# Altium schematic sheet 1_P1.schdoc
size 309 x 223 mm; Symbol: Sheet-Symbol_A4; Device: Sheet-Symbol_A4; @Page Name: P1; @Create Date: 2023-03-25; @Page Count: 1; @Page No: 1; @Project Name: NEW_clock; @Schematic Name: Schematic1; @Update Date: 2023-04-16; Company: 嘉立创EDA; Page Size: A4; Version: V1.0
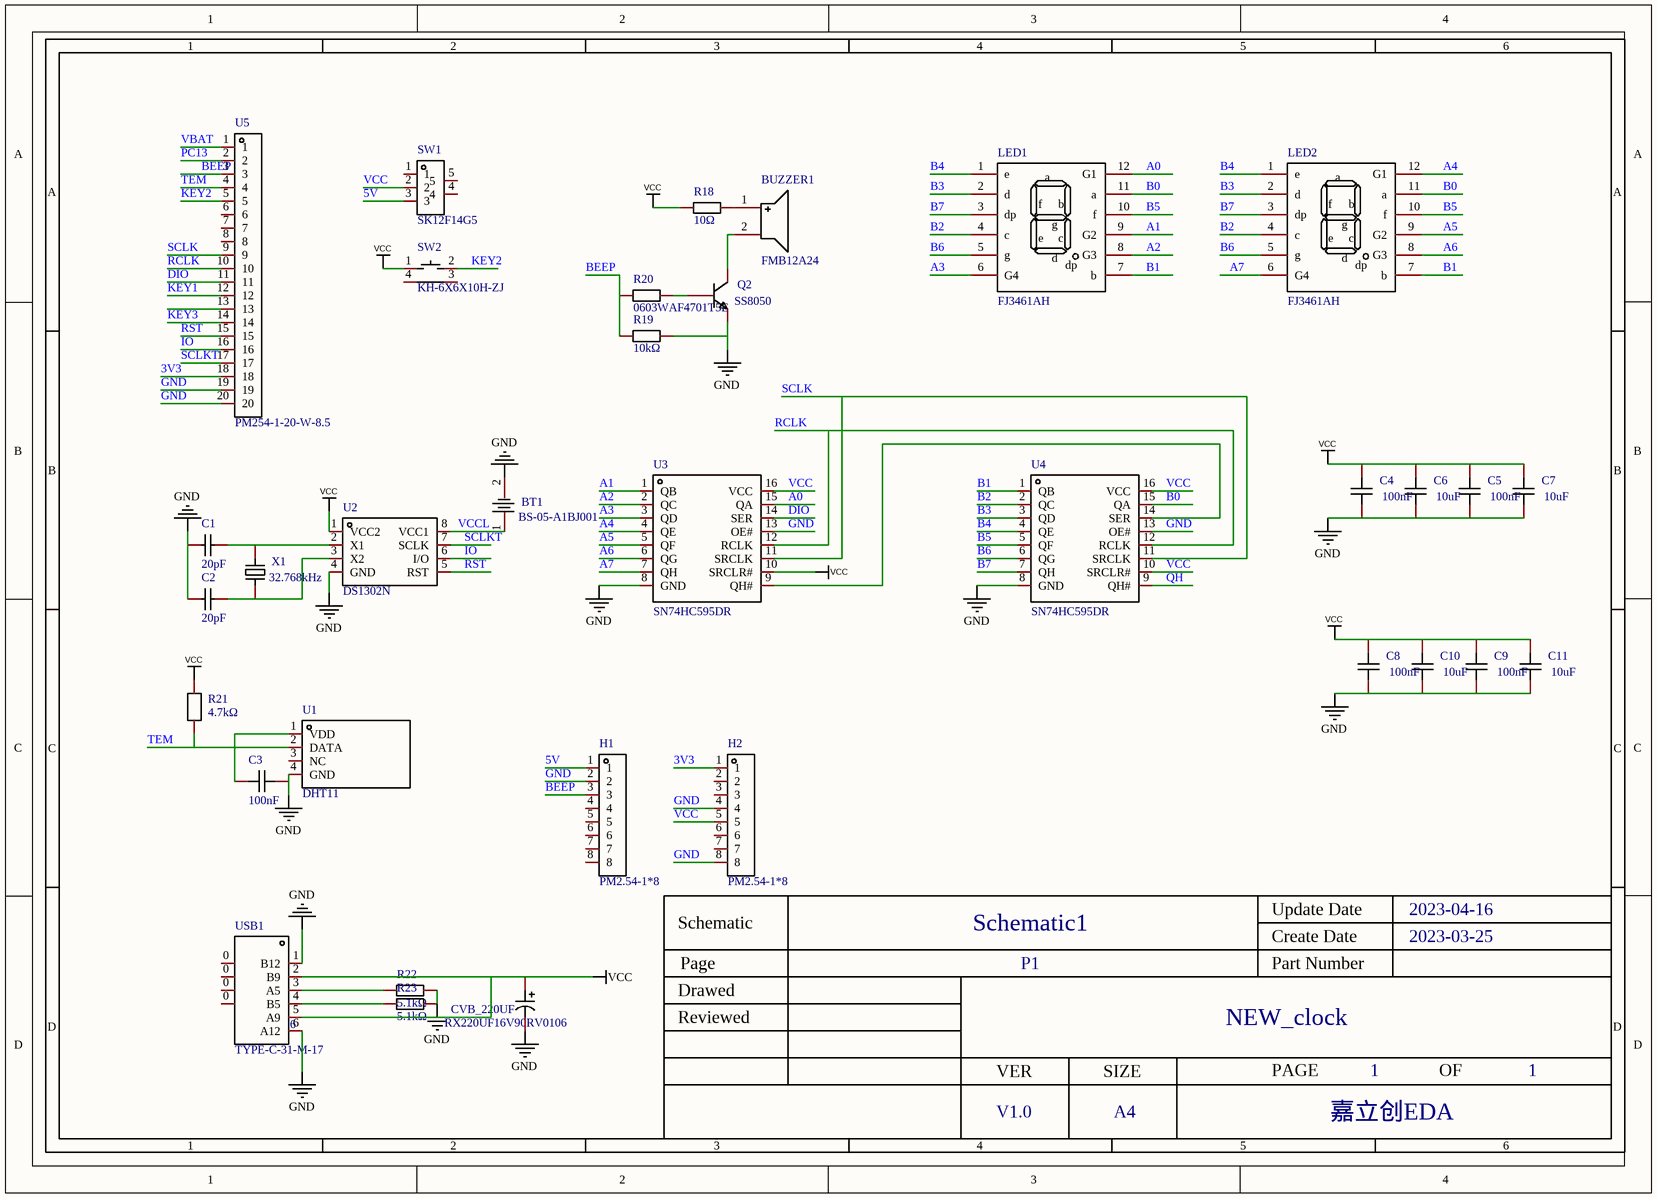
[diagram p0: 1_P1.schdoc]

## Parts
BT1  BS-05-A1BJ001  [BAT-TH_BS-05-A1BJ001]
BUZZER1  FMB12A24  [BUZ-TH_BD12.0-P7.60-D0.6-FD]
C1  20pF  [C0603]
C2  20pF  [C0603]
C3  100nF  [C0603]
C4  100nF  [C0603]
C5  100nF  [C0603]
C6  10uF  [C0603]
C7  10uF  [C0603]
C8  100nF  [C0603]
C9  100nF  [C0603]
C10  10uF  [C0603]
C11  10uF  [C0603]
CVB_220UF  RX220UF16V90RV0106  [CAP-SMD_BD6.3-L6.6-W6.6-FD-2]
H1  PM2.54-1*8  [HDR-TH_8P-P2.54-V-F]
H2  PM2.54-1*8  [HDR-TH_8P-P2.54-V-F]
LED1  FJ3461AH  [LED-SEG-TH_12P-L30.0-W14.0-P2.54-S10.16-BL]
LED2  FJ3461AH  [LED-SEG-TH_12P-L30.0-W14.0-P2.54-S10.16-BL]
Q2  SS8050  [SOT-23-3_L2.9-W1.6-P1.90-LS2.8-BR]
R18  10Ω  [R0603]
R19  10kΩ  [R0603]
R20  0603WAF4701T5E  [R0603]
R21  4.7kΩ  [R0603]
R22  5.1kΩ  [R0603]
R23  5.1kΩ  [R0603]
SW1  SK12F14G5  [SW-TH_SK12F14G5]
SW2  KH-6X6X10H-ZJ  [SW-TH_KH-6X6X10H-ZJ]
U1  DHT11  [SENSOR-TH_DHT11]
U2  DS1302N  [DIP-8_L9.7-W6.4-P2.54-LS7.6-BL]
U3  SN74HC595DR  [SOIC-16_L9.9-W3.9-P1.27-LS6.0-BL]
U4  SN74HC595DR  [SOIC-16_L9.9-W3.9-P1.27-LS6.0-BL]
U5  PM254-1-20-W-8.5  [HDR-TH_20P-P2.54-H-F-W10.0-N]
USB1  NUMBER: 6  [USB-C-SMD_10P-P1.00-L6.8-W8.9]  (hidden comment: TYPE-C-31-M-17)
X1  32.768kHz  [OSC-SMD_L3.2-W1.5]

## Nets
GND: BT1.2 C1.1 C2.1 C3.2 C4.1 C5.1 C6.1 C7.1 C8.1 C9.1 C10.1 C11.1 CVB_220UF.2 H1.2 H2.4 H2.8 Q2.2(E) R19.2 R22.2 R23.2 U1.4(GND) U2.4(GND) U3.8(GND) U3.13(OE#) U4.8(GND) U4.13(OE#) U5.19 U5.20 USB1.1(B12) USB1.6(A12)
VCC: C4.2 C5.2 C6.2 C7.2 C8.2 C9.2 C10.2 C11.2 CVB_220UF.1 H2.5 R18.1 R21.2 SW1.2 SW2.1 U2.1(VCC2) U3.10(SRCLR#) U3.16(VCC) U4.10(SRCLR#) U4.16(VCC) USB1.2(B9) USB1.5(A9)
3V3: H2.1 U5.18
5V: H1.1 SW1.3
A0: LED1.12(G1) U3.15(QA)
A1: LED1.9(G2) U3.1(QB)
A2: LED1.8(G3) U3.2(QC)
A3: LED1.6(G4) U3.3(QD)
A4: LED2.12(G1) U3.4(QE)
A5: LED2.9(G2) U3.5(QF)
A6: LED2.8(G3) U3.6(QG)
A7: LED2.6(G4) U3.7(QH)
B0: LED1.11(a) LED2.11(a) U4.15(QA)
B1: LED1.7(b) LED2.7(b) U4.1(QB)
B2: LED1.4(c) LED2.4(c) U4.2(QC)
B3: LED1.2(d) LED2.2(d) U4.3(QD)
B4: LED1.1(e) LED2.1(e) U4.4(QE)
B5: LED1.10(f) LED2.10(f) U4.5(QF)
B6: LED1.5(g) LED2.5(g) U4.6(QG)
B7: LED1.3(dp) LED2.3(dp) U4.7(QH)
BEEP: H1.3 R19.1 R20.1 U5.3
DIO: U3.14(SER) U5.11
IO: U2.6(I/O) U5.16
KEY1: U5.12
KEY2: SW2.2 U5.5
KEY3: U5.14
PC13: U5.2
QH: U4.9(QH#)
RCLK: U3.12(RCLK) U4.12(RCLK) U5.10
RST: U2.5(RST) U5.15
SCLK: U3.11(SRCLK) U4.11(SRCLK) U5.9
SCLKT: U2.7(SCLK) U5.17
TEM: R21.1 U1.2(DATA) U5.4
VBAT: U5.1
VCCL: BT1.1 U2.8(VCC1)
NetBUZZER1_1: BUZZER1.1 R18.2
NetBUZZER1_2: BUZZER1.2 Q2.3(C)
NetC1_2: C1.2 U2.2(X1) X1.2
NetC2_2: C2.2 U2.3(X2) X1.1
NetC3_1: C3.1 U1.1(VDD)
NetQ2_1: Q2.1(B) R20.2
NetR22_1: R22.1 USB1.3(A5)
NetR23_1: R23.1 USB1.4(B5)
NetU3_9: U3.9(QH#) U4.14(SER)

Not connected (* = marked no-connect by the designer): H1 4 5 6 7 8; H2 2 3 6 7; SW1 1 4 5; SW2 3 4; U1 3(NC); U5 6 7 8 13; USB1 0

## Notes on the sheet
- 1
- 2
- 3
- 4
- 5
- 6
- A
- B
- C
- Schematic
- Schematic1
- Create Date
- Update Date
- 2023-03-25
- 2023-04-16
- Reviewed
- Drawed
- Page
- P1
- Part Number
- NEW_clock
- D
- VER
- SIZE
- PAGE
- OF
- V1.0
- A4
- 嘉立创EDA

## Library data of the parts
BT1 = BS-05-A1BJ001: 连接器类型:电池底座;适用电池规格:CR2032;工作温度范围:-25℃~+85℃;; Manufacturer: MYOUNG(美阳); Add into BOM: yes; Connector Type: 电池底座; Battery Type: CR2032; NAME: 1; Pin Type: IN; Name: BS-05-A1BJ001; Symbol: BS-05-A1BJ001; Device: BS-05-A1BJ001; LCSC Part Name: 电池底座 适用电池:CR2032; Supplier Part: C964752; Manufacturer Part: BS-05-A1BJ001; Supplier Footprint: 插件; JLCPCB Part Class: 扩展库; Datasheet: https://atta.szlcsc.com/upload/public/pdf/source/20201218/C964752_93626B3EA4B13592ED1AD7E013E80C88.pdf; Supplier: LCSC; Convert to PCB: yes; Operating Temperature Range: -25℃~+85℃
BUZZER1 = FMB12A24: Manufacturer: FUET(福声科技); Add into BOM: yes; NAME: 2; Pin Type: IN; Name: FMB12A24; Symbol: FMB12A24; Device: FMB12A24; LCSC Part Name: 蜂鸣器; Supplier Part: C2690500; Manufacturer Part: FMB12A24; Supplier Footprint: 插件; JLCPCB Part Class: 扩展库; Datasheet: https://atta.szlcsc.com/upload/public/pdf/source/20210202/C2690500_100A51EE62831E1E3CE7A13A4DE031CF.pdf; Supplier: LCSC; Convert to PCB: yes
C1 C2 = CL10C200JB8NNNC: 容值:20pF;精度:±5%;额定电压:50V;材质(温度系数):C0G;; Manufacturer: SAMSUNG(三星); Add into BOM: yes; Tolerance: ±5%; Voltage Rated: 50V; Temperature Coefficient: C0G; NAME: 2; Pin Type: IN; Name: 20pF; Symbol: CL10C200JB8NNNC; Device: CL10C200JB8NNNC; LCSC Part Name: 20pF ±5% 50V; Supplier Part: C1648; Manufacturer Part: CL10C200JB8NNNC; Supplier Footprint: 0603; JLCPCB Part Class: 基础库; Datasheet: https://atta.szlcsc.com/upload/public/pdf/source/20160103/1457707686863.pdf; Supplier: LCSC; Convert to PCB: yes; Value: 20pF; NUMBER: 2
C3-C5 C8 C9 = CL10B104KB8NNNC: 容值:100nF;精度:±10%;额定电压:50V;材质(温度系数):X7R;; Manufacturer: SAMSUNG(三星); Add into BOM: yes; Tolerance: ±10%; Voltage Rated: 50V; Temperature Coefficient: X7R; NAME: 2; Pin Type: IN; Name: 100nF; Symbol: CL10B104KB8NNNC; Device: CL10B104KB8NNNC; LCSC Part Name: 100nF ±10% 50V; Supplier Part: C1591; Manufacturer Part: CL10B104KB8NNNC; Supplier Footprint: 0603; JLCPCB Part Class: 扩展库; Datasheet: https://atta.szlcsc.com/upload/public/pdf/source/20160103/1457707680512.pdf; Supplier: LCSC; Convert to PCB: yes; Value: 100nF; NUMBER: 2
C6 C7 C10 C11 = CL10A106MA8NRNC: 容值:10uF;精度:±20%;额定电压:25V;材质(温度系数):X5R;; Manufacturer: SAMSUNG(三星); Add into BOM: yes; Tolerance: ±20%; Voltage Rated: 25V; Temperature Coefficient: X5R; NAME: 2; Pin Type: IN; Name: 10uF; Symbol: CL10A106MA8NRNC; Device: CL10A106MA8NRNC; LCSC Part Name: 10uF ±20% 25V; Supplier Part: C96446; Manufacturer Part: CL10A106MA8NRNC; Supplier Footprint: 0603; JLCPCB Part Class: 基础库; Datasheet: https://atta.szlcsc.com/upload/public/pdf/source/20170325/1490427913016.pdf; Supplier: LCSC; Convert to PCB: yes; Value: 10uF; NUMBER: 2
CVB_220UF = RX220UF16V90RV0106: RX系列小型化极低阻抗系列贴片电解电容器 105℃2000小时; Manufacturer: KNSCHA(科尼盛); Add into BOM: yes; NAME: 2; Pin Type: IN; Name: RX220UF16V90RV0106; Symbol: RX220UF16V90RV0106; Device: RX220UF16V90RV0106; LCSC Part Name: 220UF 16V; Supplier Part: C3445239; Manufacturer Part: RX220UF16V90RV0106; Supplier Footprint: SMD,6.3x5.7mm; JLCPCB Part Class: 扩展库; Datasheet: https://atta.szlcsc.com/upload/public/pdf/source/20220701/150B24AB0374BC4B00A0E4548A80C050.pdf; Supplier: LCSC; Convert to PCB: yes; NUMBER: 2
H1 H2 = PM2.54-1*8: 排数:单排;总孔位数:8;间距:2.54mm;插孔结构:1x8P;行距:2.54mm;安装类型:直插;圆孔/方孔:方孔;额定电流:2.5A;插孔方向:顶部;塑高:8.5mm;工作温度范围:-40℃~+105℃;; Manufacturer: ZHOURI(洲日); Add into BOM: yes; Number of Holes: 8; Pitch: 2.54mm; Holes Structure: 1x8P; Circular Hole / Square Hole: 方孔; Current Rating (Max): 2.5A; Holes Direction: 顶部; Pin Type: IN; Name: PM2.54-1*8; Symbol: PM2.54-1*8; Device: PM2.54-1*8; LCSC Part Name: 2.54mm 1x8P; Supplier Part: C5224027; Manufacturer Part: PM2.54-1*8; Supplier Footprint: 插件,P=2.54mm; JLCPCB Part Class: 扩展库; Datasheet: https://atta.szlcsc.com/upload/public/pdf/source/20221031/E5BAE727A502DC7C69CE947E807E2296.pdf; Supplier: LCSC; Convert to PCB: yes; Number of Rows: 单排; Row Spacing: 2.54mm; Mounting Type: 直插; Insulation Height: 8.5mm; Operating Temperature Range: -40℃~+105℃
LED1 LED2 = FJ3461AH: 数字/字母大小(英寸):0.36;发光颜色:红色;; Manufacturer: 志浩; Add into BOM: yes; Digit/Alpha Size(inch): 0.36; Luminous Color: 红色; Pin Type: IN; Name: FJ3461AH; Symbol: FJ3461AH; Device: FJ3461AH; LCSC Part Name: 四位0.36英寸红色共阴数码管; Supplier Part: C10708; Manufacturer Part: FJ3461AH; Supplier Footprint: 插件; JLCPCB Part Class: 扩展库; Datasheet: https://atta.szlcsc.com/upload/public/pdf/source/20121231/1457706574766.pdf; Supplier: LCSC; Convert to PCB: yes
Q2 = SS8050_C177739: 晶体管类型:NPN;集射极击穿电压(Vceo):25V;集电极电流(Ic):1.5A;功率(Pd):300mW;集电极截止电流(Icbo):100nA;集电极-发射极饱和电压(VCE(sat)@Ic,Ib):500mV@800mA,80mA;直流电流增益(hFE@Ic,Vce):300@100mA,1V;特征频率(fT):100MHz;工作温度:+150℃@(Tj);; Manufacturer: CJ(江苏长电/长晶); Add into BOM: yes; Transistor Type: NPN; Collector-Emitter Breakdown Voltage (Vceo): 25V; Collector Current (Ic): 1.5A; Power Dissipation (Pd): 300mW; Collector Cut-Off Current (Icbo): 100nA; Transition Frequency (fT): 100MHz; NAME: E; NUMBER: 2; Pin Type: IN; Name: SS8050; Symbol: SS8050_C177739; Device: SS8050_C177739; LCSC Part Name: NPN 25V 1.5A; Supplier Part: C177739; Manufacturer Part: SS8050; Supplier Footprint: SOT-23-3; JLCPCB Part Class: 扩展库; Datasheet: https://atta.szlcsc.com/upload/public/pdf/source/20180130/C177739_15172974524031323483.pdf; Supplier: LCSC; Convert to PCB: yes; Collector-Emitter Saturation Voltage (VCE(sat)@Ic,Ib): 500mV@800mA,80mA; DC Current Gain (hFE@Ic,Vce): 300@100mA,1V; Operating Temperature: +150℃@(Tj)
R18 = RTT03100JTP: 电阻类型:厚膜电阻;阻值:10Ω;精度:±5%;功率:100mW;温度系数:±100ppm/℃;最大工作电压:75V;工作温度范围:-55℃~+155℃;; Manufacturer: RALEC(旺诠); Add into BOM: yes; Tolerance: ±5%; Power(Watts): 100mW; Overload Voltage (Max): 75V; NAME: 1; Pin Type: IN; Name: 10Ω; Symbol: RTT03100JTP; Device: RTT03100JTP; LCSC Part Name: 10Ω ±5% 100mW; Supplier Part: C103203; Manufacturer Part: RTT03100JTP; Supplier Footprint: 0603; JLCPCB Part Class: 扩展库; Datasheet: https://atta.szlcsc.com/upload/public/pdf/source/20170408/1491642781100.pdf; Supplier: LCSC; Convert to PCB: yes; Type: 厚膜电阻; Value: 10Ω; Temperature Coefficient: ±100ppm/℃; Operating Temperature Range: -55℃~+155℃; NUMBER: 1
R19 = 0603WAF1002T5E: 电阻类型:厚膜电阻;阻值:10kΩ;精度:±1%;功率:100mW;温度系数:±100ppm/℃;最大工作电压:75V;工作温度范围:-55℃~+155℃;; Manufacturer: UNI-ROYAL(厚声); Add into BOM: yes; Tolerance: ±1%; Power(Watts): 100mW; Overload Voltage (Max): 75V; NAME: 1; Pin Type: IN; Name: 10kΩ; Symbol: 0603WAF1002T5E; Device: 0603WAF1002T5E; LCSC Part Name: 10kΩ ±1% 100mW; Supplier Part: C25804; Manufacturer Part: 0603WAF1002T5E; Supplier Footprint: 0603; JLCPCB Part Class: 基础库; Datasheet: https://atta.szlcsc.com/upload/public/pdf/source/20200306/C422600_1E6D84923E4A46A82E41ADD87F860B5C.pdf; Supplier: LCSC; Convert to PCB: yes; Type: 厚膜电阻; Value: 10kΩ; Temperature Coefficient: ±100ppm/℃; Operating Temperature Range: -55℃~+155℃; NUMBER: 1
R20 = 0603WAF4701T5E: Manufacturer: UNI-ROYAL(厚声); Add into BOM: yes; NAME: 1; Pin Type: IN; Name: 0603WAF4701T5E; Symbol: 0603WAF4701T5E; Device: 0603WAF4701T5E; LCSC Part Name: 4.7KΩ(4701) ±1% 编带; Supplier Part: C23162; Manufacturer Part: 0603WAF4701T5E; Supplier Footprint: 0603; JLCPCB Part Class: 基础库; Datasheet: https://atta.szlcsc.com/upload/public/pdf/source/20170920/C23162_1505901109673982545.pdf; Supplier: LCSC; Convert to PCB: yes; NUMBER: 1
R21 = ERJ3GEYJ472V: 电阻类型:厚膜电阻;阻值:4.7kΩ;精度:±5%;功率:100mW;温度系数:±200ppm/℃;最大工作电压:-;工作温度范围:-55℃~+155℃;; Manufacturer: PANASONIC(松下); Add into BOM: yes; Tolerance: ±5%; Power(Watts): 100mW; NAME: 1; Pin Type: IN; Name: 4.7kΩ; Symbol: ERJ3GEYJ472V; Device: ERJ3GEYJ472V; LCSC Part Name: 4.7kΩ ±5% 100mW; Supplier Part: C278641; Manufacturer Part: ERJ3GEYJ472V; Supplier Footprint: 0603; JLCPCB Part Class: 扩展库; Datasheet: https://atta.szlcsc.com/upload/public/pdf/source/20190709/C278641_5D72B9BAD5739D26C99B6853E291FC31.pdf; Supplier: LCSC; Convert to PCB: yes; Type: 厚膜电阻; Value: 4.7kΩ; Temperature Coefficient: ±200ppm/℃; Overload Voltage (Max): -; Operating Temperature Range: -55℃~+155℃; NUMBER: 1
R22 R23 = 0603WAF5101T5E: 电阻类型:厚膜电阻;阻值:5.1kΩ;精度:±1%;功率:100mW;温度系数:±100ppm/℃;最大工作电压:75V;工作温度范围:-55℃~+155℃;; Manufacturer: UNI-ROYAL(厚声); Add into BOM: yes; Tolerance: ±1%; Power(Watts): 100mW; Overload Voltage (Max): 75V; NAME: 1; Pin Type: IN; Name: 5.1kΩ; Symbol: 0603WAF5101T5E; Device: 0603WAF5101T5E; LCSC Part Name: 5.1kΩ ±1% 100mW; Supplier Part: C23186; Manufacturer Part: 0603WAF5101T5E; Supplier Footprint: 0603; JLCPCB Part Class: 基础库; Datasheet: https://atta.szlcsc.com/upload/public/pdf/source/20200306/C422600_1E6D84923E4A46A82E41ADD87F860B5C.pdf; Supplier: LCSC; Convert to PCB: yes; Type: 厚膜电阻; Value: 5.1kΩ; Temperature Coefficient: ±100ppm/℃; Operating Temperature Range: -55℃~+155℃; NUMBER: 1
SW1 = SK12F14G5: 额定电流(DC)：300mA 额定电压(DC)：50V 电路结构：单刀双掷 安装方式：卧插 机械寿命：5000 滑钮形状：矩形柱状 引脚样式：PC引脚 工作温度：-10℃~+50℃ 开关长度：13.1mm 开关宽度：5.6mm 开关高度：6.1mm 柄的高度：5mm; Manufacturer: SHOU HAN(首韩); Add into BOM: yes; Pin Type: IN; Name: SK12F14G5; Symbol: SK12F14G5; Device: SK12F14G5; LCSC Part Name: SK12F14G5; Supplier Part: C2887263; Manufacturer Part: SK12F14G5; Supplier Footprint: 插件; JLCPCB Part Class: 扩展库; Datasheet: https://atta.szlcsc.com/upload/public/pdf/source/20210820/9527CA5F223E7A23E59122DED0FC191C.pdf; Supplier: LCSC; Convert to PCB: yes
SW2 = KH-6X6X10H-ZJ: 绝缘电阻:100MΩ;电路结构:单刀单掷;安装方式:卧插;按钮形状:圆形按钮;按钮/盖帽颜色:黑色;机械寿命:100000;引脚样式:PC引脚;开关长度:6mm;开关宽度:6mm;开关高度:10mm;带支架:是;; Manufacturer: kinghelm(金航标); Add into BOM: yes; Insulation Resistance: 100MΩ; Circuit: 单刀单掷; Actuator Style: 圆形按钮; Actuator/Cap Color: 黑色; Mechanical Life: 100000; Pin Style: PC引脚; Switch Length: 6mm; Switch Height: 10mm; Strike Gundam: 是; NAME: 1; Pin Type: IN; Name: KH-6X6X10H-ZJ; Symbol: KH-6X6X10H-ZJ; Device: KH-6X6X10H-ZJ; LCSC Part Name: KH-6X6X10H-ZJ 带支架; Supplier Part: C2837546; Manufacturer Part: KH-6X6X10H-ZJ; Supplier Footprint: 插件; JLCPCB Part Class: 扩展库; Datasheet: https://atta.szlcsc.com/upload/public/pdf/source/20210608/C2837546_0FA76A09E5C565D5EFC893B8AB20AAEF.pdf; Supplier: LCSC; Convert to PCB: yes; Mounting Style: 卧插; Switch Width: 6mm
U1 = DHT11: 新款电容式数字温湿度传感器,老款已停产16.1x12.6x5.8mm; Manufacturer: 广州奥松; Add into BOM: yes; Pin Type: IN; Name: DHT11; Symbol: DHT11; Device: DHT11; LCSC Part Name: DHT11  电容式传感器; Supplier Part: C117051; Manufacturer Part: DHT11; Supplier Footprint: SIP-4; Datasheet: https://atta.szlcsc.com/upload/public/pdf/source/20170703/1499081238365.pdf; Supplier: LCSC; Convert to PCB: yes
U2 = DS1302N: Manufacturer: HGSEMI(华冠); Add into BOM: yes; Pin Type: IN; Name: DS1302N; Symbol: DS1302N; Device: DS1302N; LCSC Part Name: DS1302N; Supplier Part: C398065; Manufacturer Part: DS1302N; Supplier Footprint: DIP-8; Datasheet: https://atta.szlcsc.com/upload/public/pdf/source/20200917/C398065_5315ADAE953F50FA1591ED23DB33A00E.pdf; Supplier: LCSC; Convert to PCB: yes
U3 U4 = SN74HC595DR: 逻辑电路的归属系列:74HC;逻辑类型:移位寄存器;输出类型:三态;功能:串行至并行, 串行;工作电压:2V~6V;; Manufacturer: TI(德州仪器); Add into BOM: yes; Logic Type: 移位寄存器; Output Type: 三态; Voltage - Supply: 2V~6V; Pin Type: IN; Name: SN74HC595DR; Symbol: SN74HC595DR; Device: SN74HC595DR; LCSC Part Name: SN74HC595DR; Supplier Part: C10092; Manufacturer Part: SN74HC595DR; Supplier Footprint: SOIC-16-150mil; JLCPCB Part Class: 扩展库; Datasheet: https://atta.szlcsc.com/upload/public/pdf/source/20170622/1498103874342.pdf; Supplier: LCSC; Convert to PCB: yes; Series: 74HC; Function: 串行至并行, 串行; Operating Temperature: -40℃~+85℃
U5 = PM254-1-20-W-8.5: 排数:单排;总孔位数:20;间距:2.54mm;插孔结构:1x20P;行距:-;安装类型:弯插;圆孔/方孔:方孔;额定电流:3A;额定电压:-;插孔方向:侧面;塑高:8.5mm;工作温度范围:-40℃~+105℃;; Manufacturer: HCTL(华灿天禄); Add into BOM: yes; Number of Holes: 20; Pitch: 2.54mm; Holes Structure: 1x20P; Circular Hole / Square Hole: 方孔; Current Rating (Max): 3A; Holes Direction: 侧面; Pin Type: IN; Name: PM254-1-20-W-8.5; Symbol: PM254-1-20-W-8.5; Device: PM254-1-20-W-8.5; LCSC Part Name: 2.54mm 1x20P; Supplier Part: C2897402; Manufacturer Part: PM254-1-20-W-8.5; Supplier Footprint: 弯插,P=2.54mm; JLCPCB Part Class: 扩展库; Datasheet: https://atta.szlcsc.com/upload/public/pdf/source/20211019/10E5F374A8C70BEE256048F5DCDE14A3.pdf; Supplier: LCSC; Convert to PCB: yes; Number of Rows: 单排; Row Spacing: -; Mounting Type: 弯插; Voltage Rating (Max): -; Insulation Height: 8.5mm; Operating Temperature Range: -40℃~+105℃
USB1 = TYPE-C-31-M-17: 连接器类型:Type-C;标准:-;公母:母座;触点数量:6;端口数量:1;; Manufacturer: 韩国韩荣; Add into BOM: yes; Connector Type: Type-C; Gender: 母座; Number of Ports: 1; Pin Type: IN; NAME: 0; Name: TYPE-C-31-M-17; Symbol: TYPE-C-31-M-17; Device: TYPE-C-31-M-17; LCSC Part Name: TYPE-C-31-M-17; Supplier Part: C283540; Manufacturer Part: TYPE-C-31-M-17; Supplier Footprint: -; JLCPCB Part Class: 扩展库; Datasheet: https://atta.szlcsc.com/upload/public/pdf/source/20210810/2CA2393895E95C87AA0C31BED5399791.pdf; Supplier: LCSC; Convert to PCB: yes; Standard: -; Number of Contacts: 6
X1 = FC-135 32.7680KA-A: 晶振类型:贴片无源晶振;频率:32.768kHz;频率公差:±20ppm;频率稳定度:-;负载电容:12.5pF;等效串联电阻(ESR):70kΩ;工作温度:-40℃~+85℃;; Manufacturer: EPSON(爱普生); Add into BOM: yes; Crystal Type: 贴片无源晶振; Frequency Tolerance: ±20ppm; Load Capacitance: 12.5pF; Equivalent Series Resistance (ESR): 70kΩ; NAME: 2; Pin Type: IN; Name: 32.768kHz; Symbol: FC-135 32.7680KA-A; Device: FC-135 32.7680KA-A; LCSC Part Name: 32.768kHz ±20ppm 12.5pF; Supplier Part: C1669857; Manufacturer Part: FC-135 32.7680KA-A; Supplier Footprint: SMD3215-2P; JLCPCB Part Class: 扩展库; Datasheet: https://atta.szlcsc.com/upload/public/pdf/source/20211127/C1669857_BFFF152418C2E970D8F3A70555C7D233.pdf; Supplier: LCSC; Convert to PCB: yes; Value: 32.768kHz; Frequency Stability: -; Operating Temperature: -40℃~+85℃; NUMBER: 2